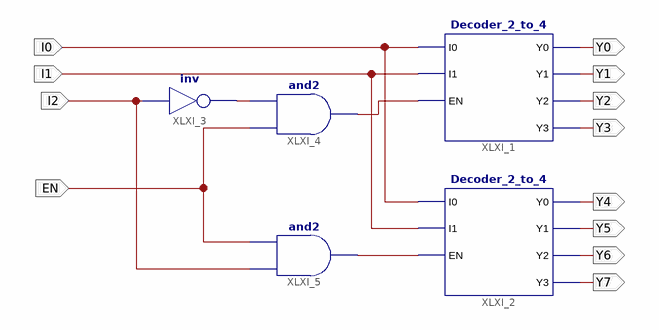
[diagram p0: schematic sheet 1]
// Xilinx ISE schematic Decoder_3_to_8.sch (spartan3e) as structural Verilog: 5 symbols, 12 ports
module Decoder_3_to_8 (
  input  EN,
  input  I2,
  input  I0,
  input  I1,
  output Y0,
  output Y1,
  output Y2,
  output Y3,
  output Y4,
  output Y5,
  output Y6,
  output Y7
);

  wire XLXN_17, XLXN_30, XLXN_31;

  Decoder_2_to_4 XLXI_1 (.EN(XLXN_30), .I0(I0), .I1(I1), .Y0(Y0), .Y1(Y1), .Y2(Y2), .Y3(Y3));
  Decoder_2_to_4 XLXI_2 (.EN(XLXN_31), .I0(I0), .I1(I1), .Y0(Y4), .Y1(Y5), .Y2(Y6), .Y3(Y7));
  not XLXI_3 (XLXN_17, I2);
  and XLXI_4 (XLXN_30, EN, XLXN_17);
  and XLXI_5 (XLXN_31, I2, EN);
endmodule
